# Altium schematic sheet Smart_Cube.SchDoc
size A2
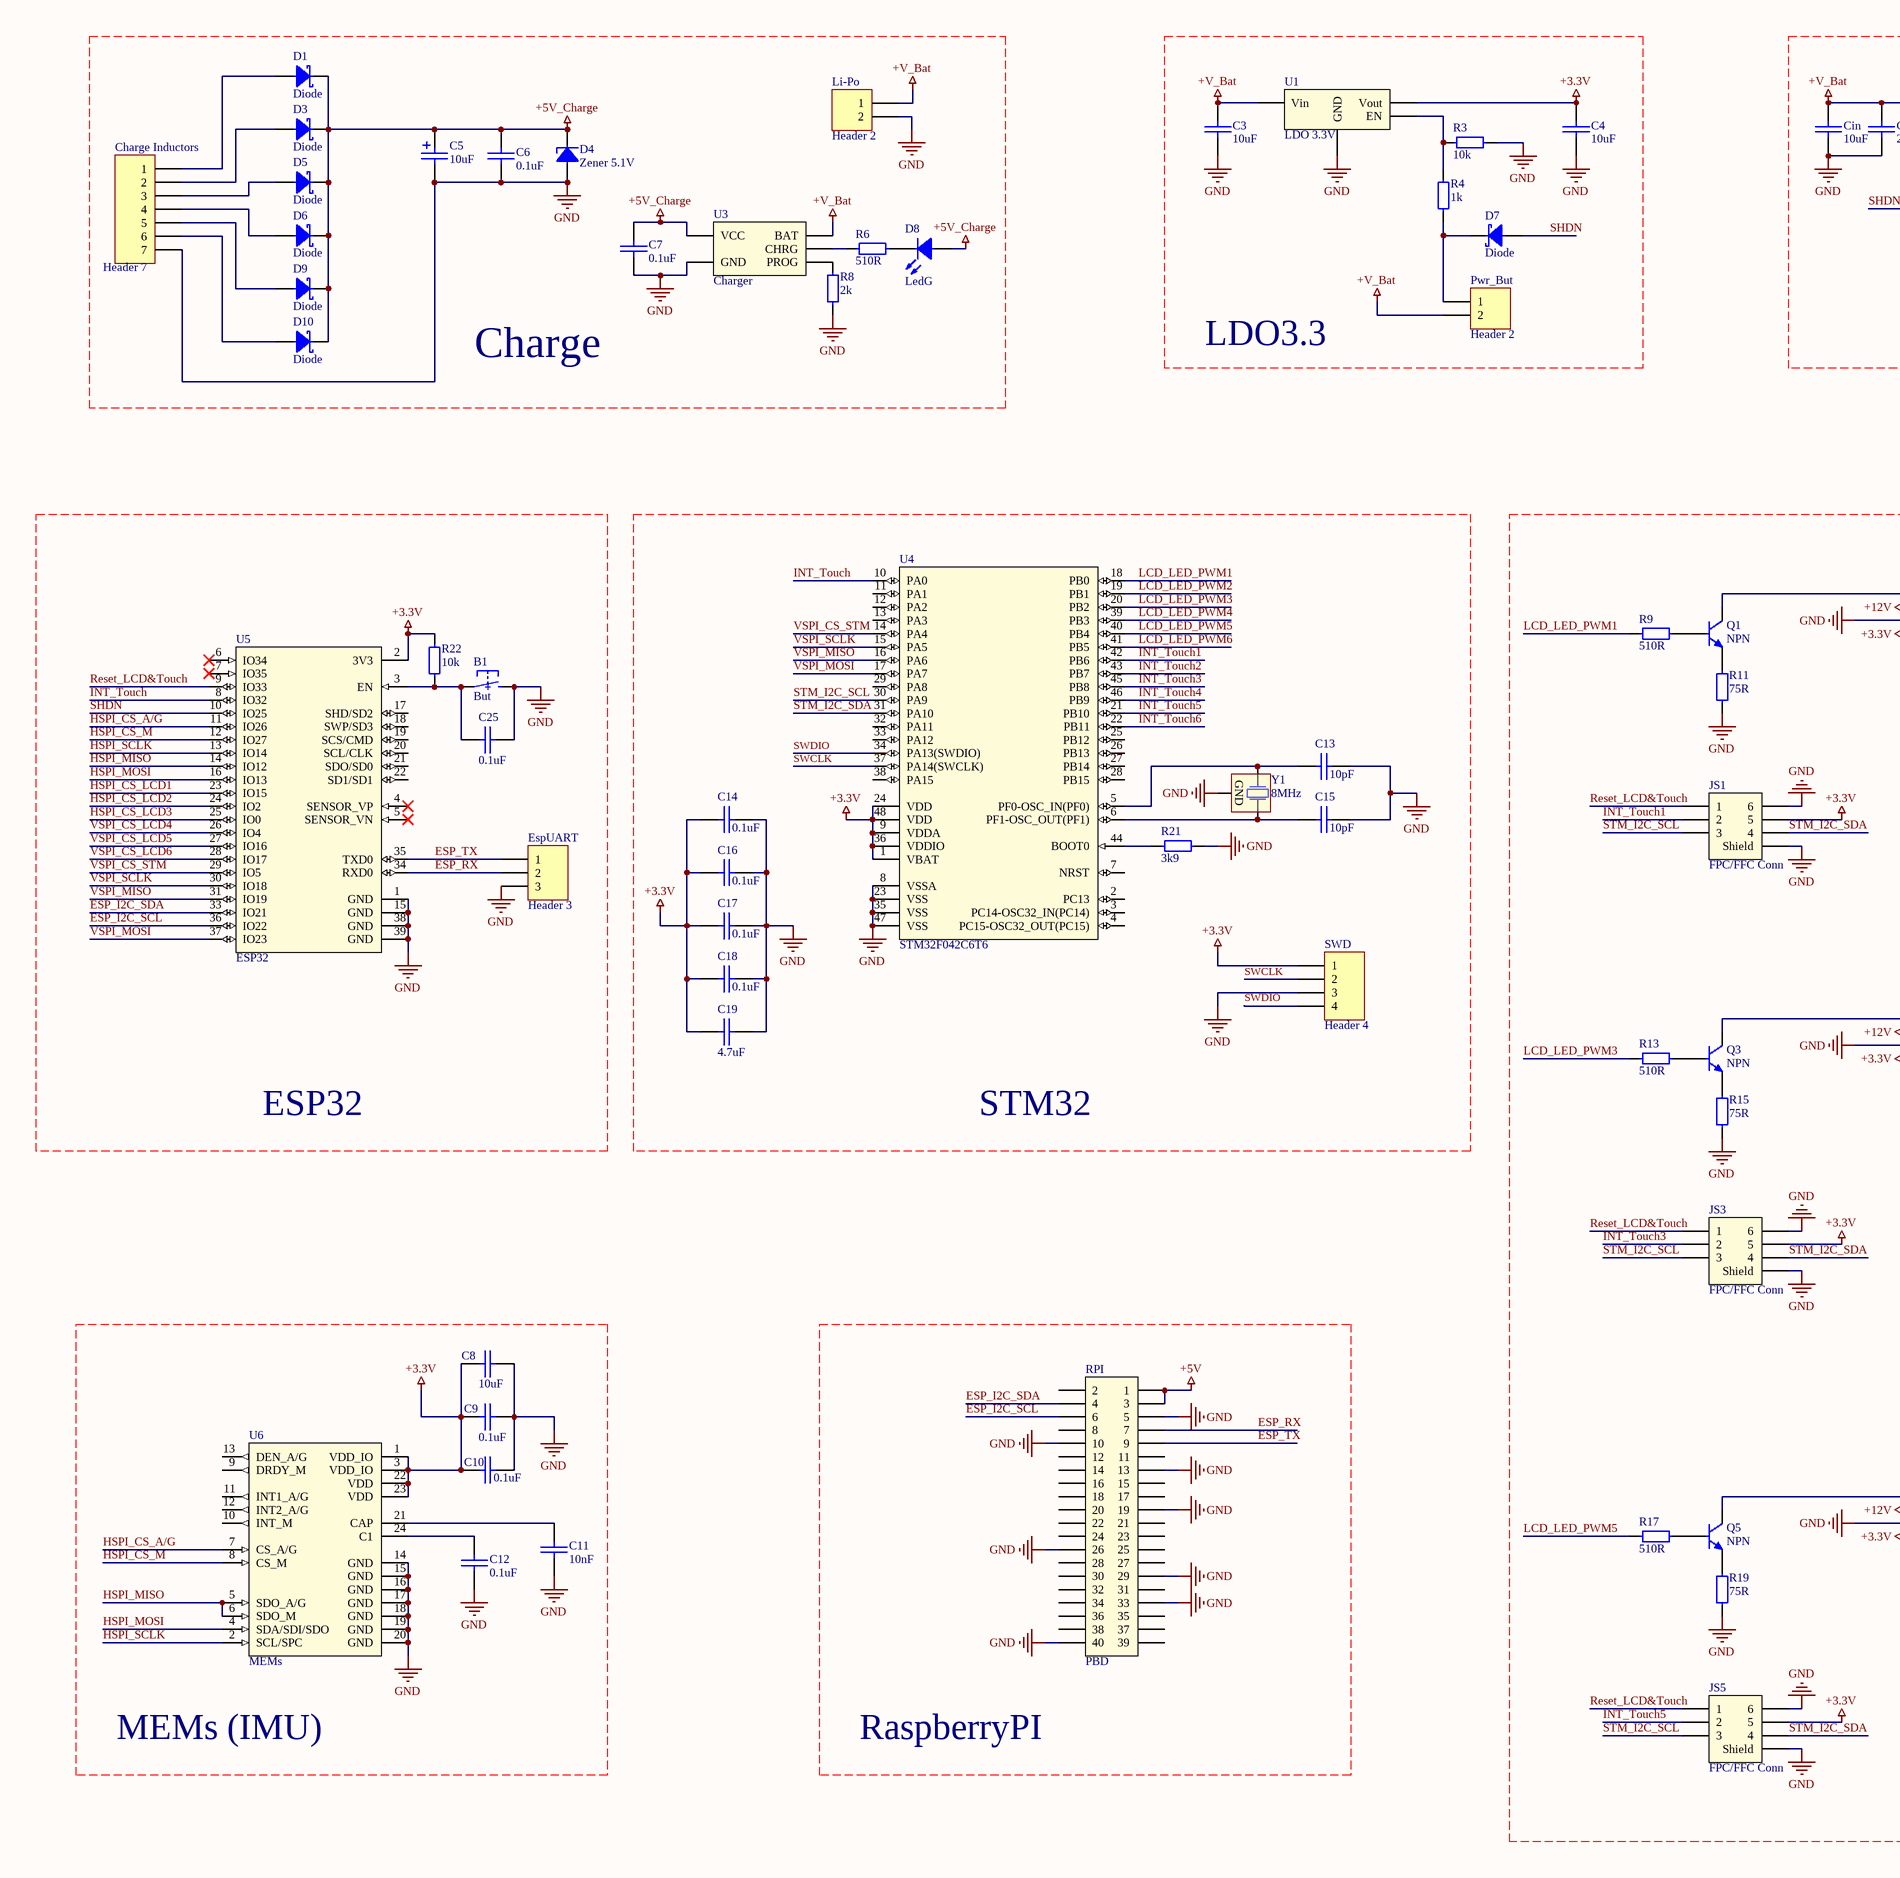
[diagram p0: Smart_Cube.SchDoc, left]
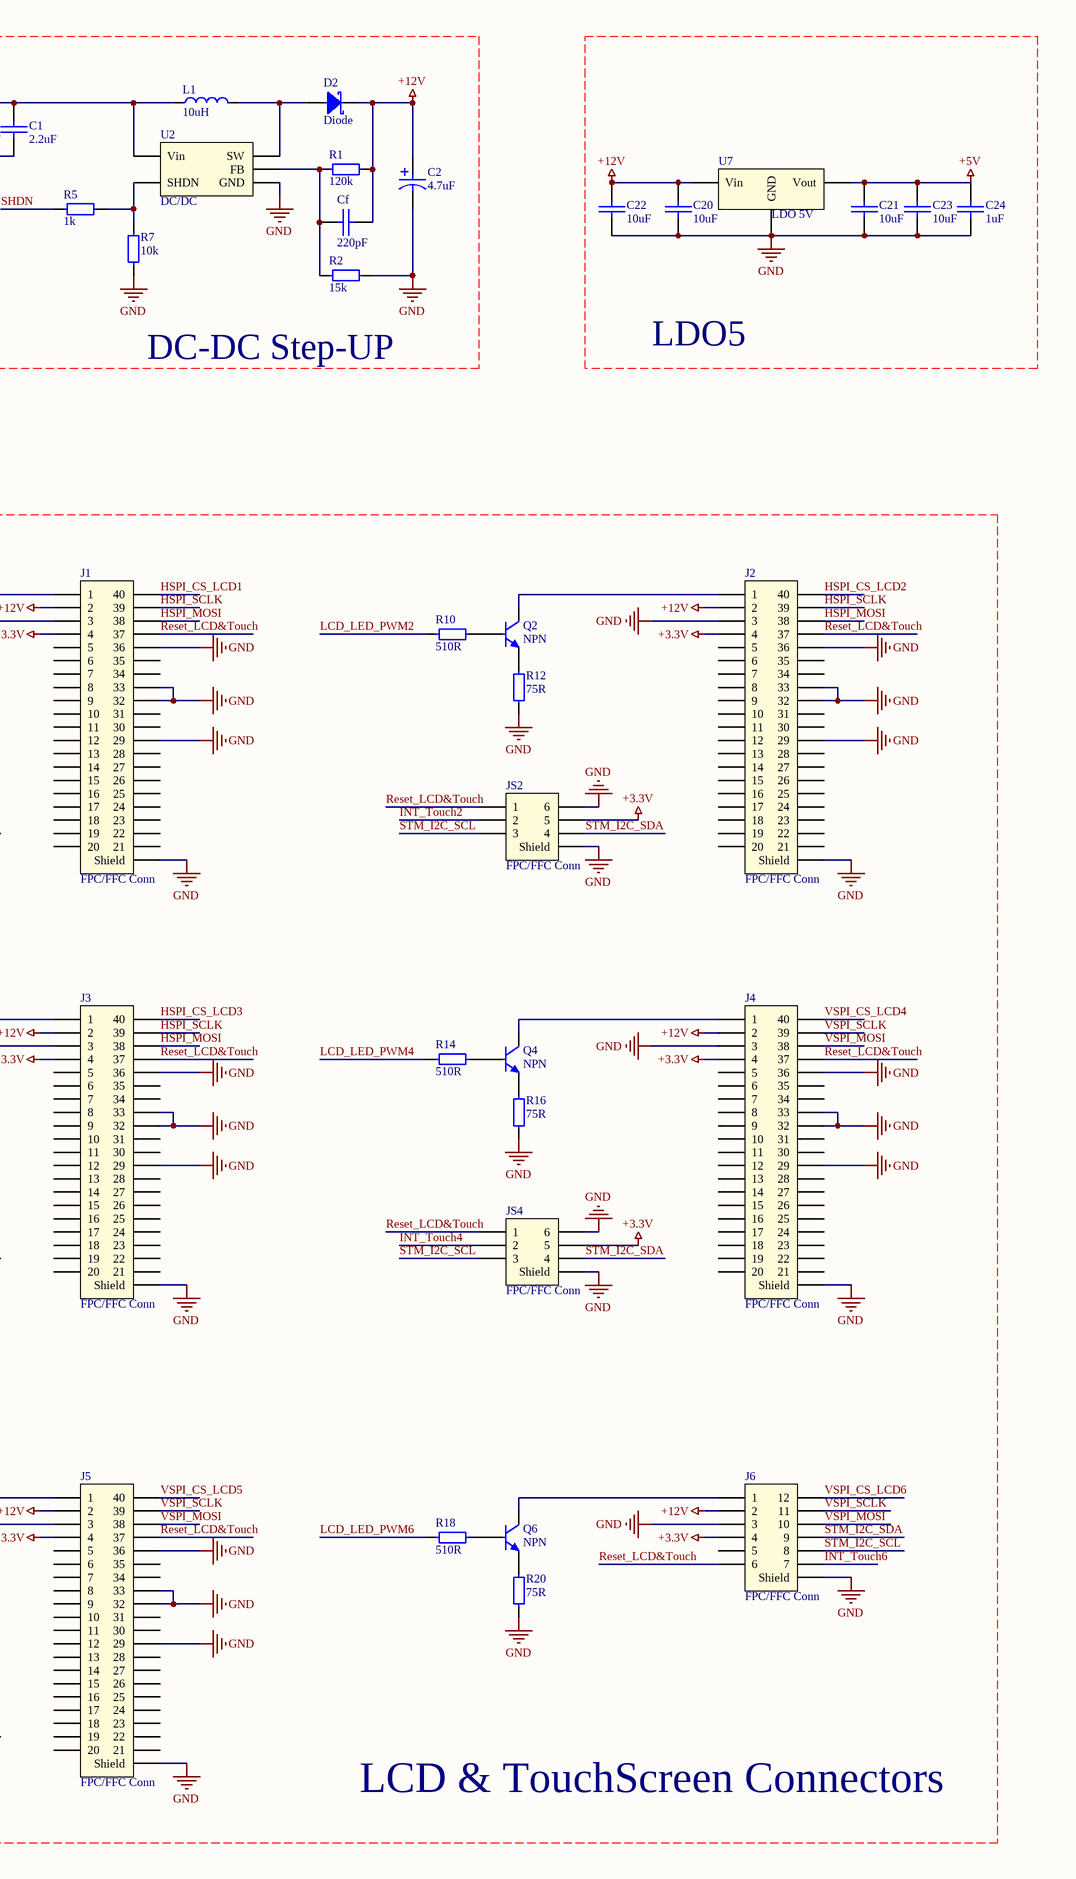
[diagram p1: Smart_Cube.SchDoc, right]

## Parts
B1  But  [BUTTON 4x3]
C1  2.2uF  [0603 Capicator]
C2  4.7uF  [Bar Cap 4x5.4]
C3  10uF  [0603 Capicator]
C4  10uF  [0603 Capicator]
C5  10uF  [TANTAL_A_CASE]
C6  0.1uF  [0603 Capicator]
C7  0.1uF  [0603 Capicator]
C8  10uF  [0603 Capicator]
C9  0.1uF  [0603 Capicator]
C10  0.1uF  [0603 Capicator]
C11  10nF  [0603 Capicator]
C12  0.1uF  [0603 Capicator]
C13  10pF  [0603 Capicator]
C14  0.1uF  [0603 Capicator]
C15  10pF  [0603 Capicator]
C16  0.1uF  [0603 Capicator]
C17  0.1uF  [0603 Capicator]
C18  0.1uF  [0603 Capicator]
C19  4.7uF  [0603 Capicator]
C20  10uF  [0603 Capicator]
C21  10uF  [0603 Capicator]
C22  10uF  [0603 Capicator]
C23  10uF  [0603 Capicator]
C24  1uF  [0603 Capicator]
C25  0.1uF  [0603 Capicator]
Cf  220pF  [0603 Capicator]
Charge_Inductors  Header 7  [HDR1X7]
Cin  10uF  [0603 Capicator]
D1  Diode  [sod-123]
D2  Diode  [sod-123]
D3  Diode  [sod-123]
D4  Zener 5.1V  [sod-323]
D5  Diode  [sod-123]
D6  Diode  [sod-123]
D7  Diode  [sod-123]
D8  LedG  [0805 LED]
D9  Diode  [sod-123]
D10  Diode  [sod-123]
EspUART  Header 3  [HDR1X3]
J1  FPC/FFC Conn  [FH12-40S Vertical]
J2  FPC/FFC Conn  [FH12-40S Vertical]
J3  FPC/FFC Conn  [FH12-40S Vertical]
J4  FPC/FFC Conn  [FH12-40S Vertical]
J5  FPC/FFC Conn  [FH12-40S Vertical]
J6  FPC/FFC Conn  [FH12-12S Vertical]
JS1  FPC/FFC Conn  [FH12-6s Vertical]
JS2  FPC/FFC Conn  [FH12-6s Vertical]
JS3  FPC/FFC Conn  [FH12-6s Vertical]
JS4  FPC/FFC Conn  [FH12-6s Vertical]
JS5  FPC/FFC Conn  [FH12-6s Vertical]
L1  10uH  [SDR]
Li-Po  Header 2  [HDR1X2]
Pwr_But  Header 2  [HDR1X2]
Q1  NPN  [SOT-23]
Q2  NPN  [SOT-23]
Q3  NPN  [SOT-23]
Q4  NPN  [SOT-23]
Q5  NPN  [SOT-23]
Q6  NPN  [SOT-23]
R1  120k  [0603 Resistor]
R2  15k  [0603 Resistor]
R3  10k  [0603 Resistor]
R4  1k  [0603 Resistor]
R5  1k  [0603 Resistor]
R6  510R  [0603 Resistor]
R7  10k  [0603 Resistor]
R8  2k  [0603 Resistor]
R9  510R  [0603 Resistor]
R10  510R  [0603 Resistor]
R11  75R  [0603 Resistor]
R12  75R  [0603 Resistor]
R13  510R  [0603 Resistor]
R14  510R  [0603 Resistor]
R15  75R  [0603 Resistor]
R16  75R  [0603 Resistor]
R17  510R  [0603 Resistor]
R18  510R  [0603 Resistor]
R19  75R  [0603 Resistor]
R20  75R  [0603 Resistor]
R21  3k9  [0603 Resistor]
R22  10k  [0603 Resistor]
RPI  PBD  [PBD 2x20]
SWD  Header 4  [HDR1X4]
U1  LDO 3.3V  [SOT-23-5]
U2  DC/DC  [SOT-23-5]
U3  Charger  [SOT-23-5]
U4  STM32F042C6T6  [LQFP48]
U5  ESP32  [ESP32-WROOM-32U]
U6  MEMs  [LGA 3.5x3x1 mm 24-lead]
U7  LDO 5V  [SOT-223]
Y1  8MHz  [Crystal ABM]

## Nets
+3.3V: C4.2 C8.1 C9.1 C10.1 C14.1 C16.1 C17.1 C18.1 C19.1 J1.4 J2.4 J3.4 J4.4 J5.4 J6.4 JS1.5 JS2.5 JS3.5 JS4.5 JS5.5 R22.2 SWD.1 U1.5(Vout) U4.1(VBAT) U4.9(VDDA) U4.24(VDD) U4.36(VDDIO) U4.48(VDD) U5.2(3V3) U6.1(VDD_IO) U6.3(VDD_IO) U6.22(VDD) U6.23(VDD)
+5V: C21.2 C23.2 C24.2 RPI.1 RPI.3 U7.2(Vout)
+5V_Charge: C5.2 C6.2 C7.2 D1.2 D3.2 D4.2 D5.2 D6.2 D8.1 D9.2 D10.2 U3.4(VCC)
+12V: C2.2 C20.2 C22.2 Cf.2 D2.2 J1.2 J2.2 J3.2 J4.2 J5.2 J6.2 R1.2 U7.3(Vin)
+V_Bat: C1.2 C3.2 Cin.2 L1.1 Li-Po.1 Pwr_But.2 U1.1(Vin) U2.5(Vin) U3.3(BAT)
GND: B1.2 C1.1 C2.1 C3.1 C4.1 C5.1 C6.1 C7.1 C8.2 C9.2 C10.2 C11.2 C12.2 C13.2 C14.2 C15.2 C16.2 C17.2 C18.2 C19.2 C20.1 C21.1 C22.1 C23.1 C24.1 C25.2 Charge_Inductors.7 Cin.1 D4.1 EspUART.3 J1.3 J1.29 J1.32 J1.33 J1.36 J1.A(Shield) J2.3 J2.29 J2.32 J2.33 J2.36 J2.A(Shield) J3.3 J3.29 J3.32 J3.33 J3.36 J3.A(Shield) J4.3 J4.29 J4.32 J4.33 J4.36 J4.A(Shield) J5.3 J5.29 J5.32 J5.33 J5.36 J5.A(Shield) J6.3 J6.A(Shield) JS1.6 JS1.A(Shield) JS2.6 JS2.A(Shield) JS3.6 JS3.A(Shield) JS4.6 JS4.A(Shield) JS5.6 JS5.A(Shield) Li-Po.2 R2.2 R3.2 R7.1 R8.1 R11.1 R12.1 R15.1 R16.1 R19.1 R20.1 R21.2 RPI.5 RPI.10 RPI.13 RPI.19 RPI.26 RPI.29 RPI.33 RPI.40 SWD.3 U1.2(GND) U2.2(GND) U3.2(GND) U4.8(VSSA) U4.23(VSS) U4.35(VSS) U4.47(VSS) U5.1(GND) U5.15(GND) U5.38(GND) U5.39(GND) U6.14(GND) U6.15(GND) U6.16(GND) U6.17(GND) U6.18(GND) U6.19(GND) U6.20(GND) U7.1(GND) Y1.GND
ESP_I2C_SCL: RPI.6 U5.36(IO22)
ESP_I2C_SDA: RPI.4 U5.33(IO21)
ESP_RX: EspUART.2 RPI.7 U5.34(RXD0)
ESP_TX: EspUART.1 RPI.9 U5.35(TXD0)
HSPI_CS_A/G: U5.11(IO26) U6.7(CS_A/G)
HSPI_CS_LCD1: J1.40 U5.23(IO15)
HSPI_CS_LCD2: J2.40 U5.24(IO2)
HSPI_CS_LCD3: J3.40 U5.25(IO0)
HSPI_CS_M: U5.12(IO27) U6.8(CS_M)
HSPI_MISO: U5.14(IO12) U6.5(SDO_A/G) U6.6(SDO_M)
HSPI_MOSI: J1.38 J2.38 J3.38 U5.16(IO13) U6.4(SDA/SDI/SDO)
HSPI_SCLK: J1.39 J2.39 J3.39 U5.13(IO14) U6.2(SCL/SPC)
INT_Touch: U4.10(PA0) U5.8(IO32)
INT_Touch1: JS1.2 U4.42(PB6)
INT_Touch2: JS2.2 U4.43(PB7)
INT_Touch3: JS3.2 U4.45(PB8)
INT_Touch4: JS4.2 U4.46(PB9)
INT_Touch5: JS5.2 U4.21(PB10)
INT_Touch6: J6.7 U4.22(PB11)
LCD_LED_PWM1: R9.1 U4.18(PB0)
LCD_LED_PWM2: R10.1 U4.19(PB1)
LCD_LED_PWM3: R13.1 U4.20(PB2)
LCD_LED_PWM4: R14.1 U4.39(PB3)
LCD_LED_PWM5: R17.1 U4.40(PB4)
LCD_LED_PWM6: R18.1 U4.41(PB5)
Reset_LCD&Touch: J1.37 J2.37 J3.37 J4.37 J5.37 J6.6 JS1.1 JS2.1 JS3.1 JS4.1 JS5.1 U5.9(IO33)
SHDN: D7.1 R5.2 U5.10(IO25)
STM_I2C_SCL: J6.8 JS1.3 JS2.3 JS3.3 JS4.3 JS5.3 U4.30(PA9)
STM_I2C_SDA: J6.9 JS1.4 JS2.4 JS3.4 JS4.4 JS5.4 U4.31(PA10)
SWCLK: SWD.2 U4.37(PA14(SWCLK))
SWDIO: SWD.4 U4.34(PA13(SWDIO))
VSPI_CS_LCD4: J4.40 U5.26(IO4)
VSPI_CS_LCD5: J5.40 U5.27(IO16)
VSPI_CS_LCD6: J6.12 U5.28(IO17)
VSPI_CS_STM: U4.14(PA4) U5.29(IO5)
VSPI_MISO: U4.16(PA6) U5.31(IO19)
VSPI_MOSI: J4.38 J5.38 J6.10 U4.17(PA7) U5.37(IO23)
VSPI_SCLK: J4.39 J5.39 J6.11 U4.15(PA5) U5.30(IO18)
NetB1_1: B1.1 C25.1 R22.1 U5.3(EN)
NetC11_1: C11.1 U6.21(CAP)
NetC12_1: C12.1 U6.24(C1)
NetC13_1: C13.1 U4.5(PF0-OSC_IN(PF0)) Y1.1
NetC15_1: C15.1 U4.6(PF1-OSC_OUT(PF1)) Y1.2
NetCf_1: Cf.1 R1.1 R2.1 U2.3(FB)
NetCharge_Inductors_1: Charge_Inductors.1 D1.1
NetCharge_Inductors_2: Charge_Inductors.2 D3.1
NetCharge_Inductors_3: Charge_Inductors.3 D5.1
NetCharge_Inductors_4: Charge_Inductors.4 D6.1
NetCharge_Inductors_5: Charge_Inductors.5 D9.1
NetCharge_Inductors_6: Charge_Inductors.6 D10.1
NetD2_1: D2.1 L1.2 U2.1(SW)
NetD7_2: D7.2 Pwr_But.1 R4.1
NetD8_2: D8.2 R6.2
NetJ1_1: J1.1 Q1.3
NetJ2_1: J2.1 Q2.3
NetJ3_1: J3.1 Q3.3
NetJ4_1: J4.1 Q4.3
NetJ5_1: J5.1 Q5.3
NetJ6_1: J6.1 Q6.3
NetQ1_1: Q1.1 R9.2
NetQ1_2: Q1.2 R11.2
NetQ2_1: Q2.1 R10.2
NetQ2_2: Q2.2 R12.2
NetQ3_1: Q3.1 R13.2
NetQ3_2: Q3.2 R15.2
NetQ4_1: Q4.1 R14.2
NetQ4_2: Q4.2 R16.2
NetQ5_1: Q5.1 R17.2
NetQ5_2: Q5.2 R19.2
NetQ6_1: Q6.1 R18.2
NetQ6_2: Q6.2 R20.2
NetR3_1: R3.1 R4.2 U1.3(EN)
NetR5_1: R5.1 R7.2 U2.4(SHDN)
NetR6_1: R6.1 U3.1(CHRG)
NetR8_2: R8.2 U3.5(PROG)
NetR21_1: R21.1 U4.44(BOOT0)

Not connected (* = marked no-connect by the designer): J1 5 6 7 8 9 10 11 12 13 14 15 16 17 18 19 20 21 22 23 24 25 26 27 28 30 31 34 35; J2 5 6 7 8 9 10 11 12 13 14 15 16 17 18 19 20 21 22 23 24 25 26 27 28 30 31 34 35; J3 5 6 7 8 9 10 11 12 13 14 15 16 17 18 19 20 21 22 23 24 25 26 27 28 30 31 34 35; J4 5 6 7 8 9 10 11 12 13 14 15 16 17 18 19 20 21 22 23 24 25 26 27 28 30 31 34 35; J5 5 6 7 8 9 10 11 12 13 14 15 16 17 18 19 20 21 22 23 24 25 26 27 28 30 31 34 35; J6 5; RPI 2 8 11 12 14 15 16 17 18 20 21 22 23 24 25 27 28 30 31 32 34 35 36 37 38 39; U4 2(PC13) 3(PC14-OSC32_IN(PC14)) 4(PC15-OSC32_OUT(PC15)) 7(NRST) 11(PA1) 12(PA2) 13(PA3) 25(PB12) 26(PB13) 27(PB14) 28(PB15) 29(PA8) 32(PA11) 33(PA12) 38(PA15); U5 4(SENSOR_VP)* 5(SENSOR_VN)* 6(IO34)* 7(IO35)* 17(SHD/SD2) 18(SWP/SD3) 19(SCS/CMD) 20(SCL/CLK) 21(SDO/SD0) 22(SD1/SD1); U6 9(DRDY_M) 10(INT_M) 11(INT1_A/G) 12(INT2_A/G) 13(DEN_A/G)

## Notes on the sheet
- Charge
- LDO3.3
- DC-DC Step-UP
- LDO5
- ESP32
- STM32
- MEMs (IMU)
- RaspberryPI
- LCD & TouchScreen Connectors

## Library data of the parts
B1 = Button 2 Conn: Button 2 Conn SMD; Part Number: L-KLS7-TS3608-5.0-180; Manufacturer: KLS electronic co ltd; Type: Button; ComponentLink1Description: Chip&Dip; ComponentLink1URL: https://www.chipdip.ru/product/kls7-ts3608-5.0-180-td-02xa
C1 = Cap 2.2uF (0603): 2.2uF X5R 10V 10% 0603; Manufacturer: Murata Manufacturing; Part Number: GRM188R61A225KE34D; Type: Capacitor; ComponentLink1Description: Chip&Dip; ComponentLink1URL: https://www.chipdip.ru/product/grm188r61a225k
C2 = Cap Pol 4.7uF: ECAP SMD,  35V, 105°C; Part Number: B41121A7475M000; Manufacturer: Epcos; Type: Capacitor; ComponentLink1Description: Chip&Dip; ComponentLink1URL: https://www.chipdip.ru/product/b41121a7475m000
C3 C4 C8 C20-C23 = Cap 10uF (0603): 10uF X5R 25V 20% 0603; Manufacturer: Murata Manufacturing; Part Number: GRM188R61E106M; Type: Capacitor; ComponentLink1Description: Chip&Dip; ComponentLink1URL: https://www.chipdip.ru/product/grm188r61e106m
C5 = Cap Tantal 10uF (SMDA): TECAP, 10uF, 16V, case A, 10%; Part Number: 373033076; Manufacturer: China; Type: Capacitor; ComponentLink1Description: Chip&Dip; ComponentLink1URL: https://www.chipdip.ru/product0/373033076
C6 C7 C9 C10 C12 C14 C16-C18 C25 = Cap 0.1uF (0603): 0.1uF X7R 16V 10% 0603; Manufacturer: Murata Manufacturing; Part Number: GRM188R71C104KA01D; Type: Capacitor; ComponentLink1Description: Chip&Dip; ComponentLink1URL: https://www.chipdip.ru/product/grm188r71c104ka01d
C11 = Cap 10nF (0603): X7R 10nF 100V 10% 0603; Manufacturer: Murata Manufacturing; Part Number: GRM188R72A103KA01D; Type: Capacitor; ComponentLink1Description: Chip&Dip; ComponentLink1URL: https://www.chipdip.ru/product/grm188r72a103ka01d
C13 C15 = Cap 10pF (0603): 10pF NP0 50V 5% 0603; Manufacturer: Murata Manufacturing; Part Number: GRM1885C1H100JA01D; Type: Capacitor; ComponentLink1Description: Chip&Dip; ComponentLink1URL: https://www.chipdip.ru/product/grm1885c1h100j
C19 = Cap 4.7uF (0603): 4.7uF X5R 6.3V 10% 0603; Manufacturer: Murata Manufacturing; Part Number: GRM188R60J475KE19D; Type: Capacitor; ComponentLink1Description: Chip&Dip; ComponentLink1URL: https://www.chipdip.ru/product/grm185r60g475me15d
C24 = Cap 1uF (0603): 1uF X5R 25V 10% 0603; Manufacturer: Murata Manufacturing; Part Number: GRM188R61E105KAADD; Type: Capacitor; ComponentLink1Description: Chip&Dip; ComponentLink1URL: https://www.chipdip.ru/product/grm188r61e105k
Cf = Cap 220pF (0603): 220pF NP0 50V 5% 0603; Manufacturer: Murata Manufacturing; Part Number: GRM1885C1H221J; Type: Capacitor; ComponentLink1Description: Chip&Dip; ComponentLink1URL: https://www.chipdip.ru/product/grm1885c1h221j
Charge_Inductors = Header 7: Header, 7-Pin; LatestRevisionDate: 17-Jul-2002; LatestRevisionNote: Re-released for DXP Platform.; Publisher: Altium Limited
Cin = Cap 10uF (0603): 10uF X5R 25V 20% 0603; Manufacturer: Murata Manufacturing; Part Number: GRM188R61E106M; Type: Capacitor; ComponentLink1Description: Chip&Dip; ComponentLink1URL: https://www.chipdip.ru/product/grm188r61e106m
D1-D3 D5-D7 D9 D10 = Diode Schottky (SOD-123): 0.5 A, Low Forward Voltage less than 385 mV, 400 mW Power Dissipation Package; Part Number: MBR0520L; Manufacturer: ON Semiconductor; Type: Diode; ComponentLink1Description: DataSheet; ComponentLink1URL: http://www.farnell.com/datasheets/1875336.pdf; ComponentLink2Description: Chip&Dip; ComponentLink2URL: https://www.chipdip.ru/product/mbr0520l
D4 = Zener Diode 5.1V: 300mW; Part Number: BZX384-C5V1,115; Manufacturer: Nexperia; Type: Diode; ComponentLink1Description: Chip&Dip; ComponentLink1URL: https://www.chipdip.ru/product/bzx384-c5v1; ComponentLink2Description: DataSheet; ComponentLink2URL: https://static.chipdip.ru/lib/164/DOC001164636.pdf
D8 = Led Green: Led Green SMD 1608, 120°, 525nM; Part Number: TO-1608BC-PG; Manufacturer: Taiwan Oasis Technology; Type: Diode; ComponentLink1Description: Chip&Dip; ComponentLink1URL: https://www.chipdip.ru/product/to-1608bc-pg
EspUART = Header 3: Header, 3-Pin; LatestRevisionDate: 17-Jul-2002; LatestRevisionNote: Re-released for DXP Platform.; Publisher: Altium Limited
J1-J5 = Conn40x1 (FH12 Vertical): Connector to Display's trail; Part Number: FH12-40S-0.5SVA(54); Manufacturer: Hirose Electric; Type: Connector; ComponentLink1Description: Chip&Dip; ComponentLink1URL: https://www.chipdip.ru/product1/8002082143
J6 = Conn12x1 (FH12 Vertical): Connector to trail; Part Number: FH12-12S-0.5SVA(54); Manufacturer: Hirose Electric; Type: Connector; ComponentLink1Description: Mouser; ComponentLink1URL: https://ru.mouser.com/ProductDetail/Hirose-Connector/FH12-12S-05SVA54?qs=%2Fha2pyFadugx2rsdyHDVcXwbI8krQaq6%252BPNTW5YGSdYzC8JBsy5pU75ViyDjvRCP
JS1-JS5 = Conn6x1 (FH12 Vertical): Connector to touch sensor's trail; Part Number: FH12-6S-0.5SVA(54); Manufacturer: Hirose Electric; Type: Connector; ComponentLink1Description: Mouser; ComponentLink1URL: https://ru.mouser.com/ProductDetail/Hirose-Connector/FH12-6S-05SVA54?qs=%2Fha2pyFaduhYbZFVunKSgIpYMlkzngMoGcACEbztduQ1P2V6tcZCQQ%3D%3D
L1 = Inductor 10uH (1.5A): 10uH, D=5.8mm, 1450mA; Part Number: SDR0604-100ML; Manufacturer: Bourns; Type: Inductor; ComponentLink1Description: DataSheet; ComponentLink1URL: http://www.farnell.com/datasheets/1635216.pdf; ComponentLink2Description: Chip&Dip; ComponentLink2URL: https://www.chipdip.ru/product/sdr0604-100ml
Li-Po Pwr_But = Header 2: Header, 2-Pin; LatestRevisionDate: 17-Jul-2002; LatestRevisionNote: Re-released for DXP Platform.; Publisher: Altium Limited
Q1-Q6 = NPN [BC817]: NPN general-purpose transistors; Part Number: BC817-40,215; Manufacturer: Nexperia; Type: Transistor; ComponentLink1Description: DataSheet; ComponentLink1URL: https://static.chipdip.ru/lib/156/DOC000156781.pdf; ComponentLink2Description: Chip&Dip; ComponentLink2URL: https://www.chipdip.ru/product/bc817-40
R1 = Res 120k (0603): 0.1W 0603 120k, 1%; Part Number: RC0603FR-07120KL; Manufacturer: Taiwan; Type: Resistor; ComponentLink1Description: Chip&Dip; ComponentLink1URL: https://www.chipdip.ru/product0/9000079762
R2 = Res 15k (0603): 0.1W 0603 15k, 1%; Part Number: RC0603FR-0715KL; Manufacturer: Taiwan; Type: Resistor; ComponentLink1Description: Chip&Dip; ComponentLink1URL: https://www.chipdip.ru/product0/9000079740
R3 R7 R22 = Res 10k (0603): 0.1W 0603 10k, 1%; Part Number: RC0603FR-0710KL; Manufacturer: Taiwan; Type: Resistor; ComponentLink1Description: Chip&Dip; ComponentLink1URL: https://www.chipdip.ru/product0/9000079736
R4 R5 = Res 1k (0603): 0.1W 0603 1k, 1%; Part Number: RC0603FR-071KL; Manufacturer: Taiwan; Type: Resistor; ComponentLink1Description: Chip&Dip; ComponentLink1URL: https://www.chipdip.ru/product0/9000079676
R6 R9 R10 R13 R14 R17 R18 = Res 510R (0603): 0.1W 0603 510R, 1%; Part Number: RC0603FR-07510RL; Manufacturer: Taiwan; Type: Resistor; ComponentLink1Description: Chip&Dip; ComponentLink1URL: https://www.chipdip.ru/product0/9000079669
R8 = Res 2k (0603): 0.1W 0603 2k, 1%; Part Number: RC0603FR-072KL; Manufacturer: Taiwan; Type: Resistor; ComponentLink1Description: Chip&Dip; ComponentLink1URL: https://www.chipdip.ru/product0/9000079719
R11 R12 R15 R16 R19 R20 = Res 75R (0603): 0.1W 0603 75R, 1%; Part Number: RC0603FR-0775RL; Manufacturer: Taiwan; Type: Resistor; ComponentLink1Description: Chip&Dip; ComponentLink1URL: https://www.chipdip.ru/product0/9000079613
R21 = Res 3.9k (0603): 0.1W 0603 3.9k, 1%; Part Number: RC0603FR-073K9L; Manufacturer: Taiwan; Type: Resistor; ComponentLink1Description: Chip&Dip; ComponentLink1URL: https://www.chipdip.ru/product0/9000079726
RPI = Conn20x2 (PBD): Female for PLD; Part Number: DS1023-2*20S21; Manufacturer: Ningbo connfly electronic; Type: Connector; ComponentLink1Description: Chip&Dip; ComponentLink1URL: https://www.chipdip.ru/product/pbd-40
SWD = Header 4: Header, 4-Pin; LatestRevisionDate: 17-Jul-2002; LatestRevisionNote: Re-released for DXP Platform.; Publisher: Altium Limited
U1 = LDO 3.3V [LM]: low-dropout linear regulator. There are devices designed specifically for battery-operated systems. Ground current is very small (50uA-Typ), that significantly extending battery life. Low power consumption and high accuracy is achieved through CMOS and programmable fuse technologies. Output voltage: 1.5V to 6.0V.; Part Number: LM8805SF5-3.3; Manufacturer: TAEJIN TECHNOLOGY; ComponentLink1Description: DataSheet; ComponentLink1URL: https://static.chipdip.ru/lib/138/DOC004138842.pdf; ComponentLink2Description: Chip&Dip; ComponentLink2URL: https://www.chipdip.ru/product/lm8805sf5-3.3
U2 = DC/DC Controller [LM2731]: The  LM2731  switching  regulators  are  current-mode  boostconverters  operating  at  fixed  frequencies  of  1.6  MHz  (“X”option) and 600 kHz (“Y” option).; Manufacturer: Texas Instruments; Part Number: LM2731YMF/NOPB; ComponentLink1Description: Chip&Dip; ComponentLink1URL: https://www.chipdip.ru/product/lm2731ymf-nopb; ComponentLink2Description: DataSheet; ComponentLink2URL: https://static.chipdip.ru/lib/491/DOC000491907.pdf; Type: IC
U3 = Charger [LTC]: The LTC®4054 is a complete constant-current/constant-voltage linear charger for single cell lithium-ion batteries.Its ThinSOT package and low external component countmake the LTC4054 ideally suited for portable applications.Furthermore, the LTC4054 is specifically designed to workwithin USB power specifications; Part Number: LTC4054ES5-4.2#PBF; Manufacturer: Linear Technology; ComponentLink2Description: Chip&Dip; ComponentLink2URL: https://www.chipdip.ru/product/ltc4054es5-4.2; Type: IC; ComponentLink3Description: DataSheet; ComponentLink3URL: https://static.chipdip.ru/lib/760/DOC000760847.pdf
U4 = STM32F042C6T6: ARM®-based 32-bit MCU, up to 32 KB Flash, crystal-less USB / FS 2.0, CAN, 9 timers, ADC and comm. interfaces, 2.0 - 3.6 V; Manufacturer: STMicroelectronics; Part Number: STM32F042C6T6; ComponentLink1Description: DataSheet; ComponentLink1URL: https://ru.mouser.com/datasheet/2/389/stm32f042c4-956225.pdf; ComponentLink2Description: Chip&Dip; ComponentLink2URL: https://www.chipdip.ru/product1/8000831125; Type: IC
U5 = ESP32-WROOM (D0WD): ESP32-WROOM-32 is a powerful, generic Wi-Fi+BT+BLE MCU module that targets a wide variety of applications,ranging from low-power sensor networks to the most demanding tasks, such as voice encoding, music streamingand MP3 decoding; Part Number: ESP32-WROOM-32U (16MB); Manufacturer: Espressif Systems; ComponentLink1Description: Mouser; ComponentLink1URL: https://ru.mouser.com/ProductDetail/Espressif-Systems/ESP32-WROOM-32U-16MB?qs=sGAEpiMZZMu3sxpa5v1qrsMD9%252BwKyL2mrwTVktUnYUY%3D; ComponentLink2Description: DataSheet; ComponentLink2URL: https://ru.mouser.com/datasheet/2/891/esp32-wroom-32d_esp32-wroom-32u_datasheet_en-1365844.pdf; Type: IC
U6 = MEMs 9 Axis: System-in-package featuring a 3D digital linear acceleration sensor, a 3D digital angular rate sensor, and a 3D digital magnetic sensor; Manufacturer: STMicroelectronics; Part Number: LSM9DS1TR; ComponentLink1Description: DataSheet; ComponentLink1URL: https://static.chipdip.ru/lib/427/DOC004427868.pdf; ComponentLink2Description: Chip&Dip; ComponentLink2URL: https://www.chipdip.ru/product/lsm9ds1tr; Type: IC
U7 = LDO 5V [LM]: A low dropout Linear Regulator with a dropout of 5V at 800mA of load current; Part Number: LM1117IMPX-5.0/NOPB; Manufacturer: Texas Instruments; ComponentLink1Description: DataSheet; ComponentLink1URL: https://static.chipdip.ru/lib/276/DOC000276680.pdf; ComponentLink2Description: Chip&Dip; ComponentLink2URL: https://www.chipdip.ru/product/lm1117impx-5.0-nopb
Y1 = Crystal 8MHz [ABM]: 8.0MHz 10pf 10ppm -10C +60C; Manufacturer: ABRACON; Part Number: ABM3B-8.000MHZ-10-1UT; Type: Crystal; ComponentLink1Description: Mouser; ComponentLink1URL: https://ru.mouser.com/ProductDetail/ABRACON/ABM3B-8000MHZ-10-1UT?qs=sGAEpiMZZMsBj6bBr9Q9aQYUWCbsL2Wc65je5Ut7byg%3D; ComponentLink2Description: DataSheet; ComponentLink2URL: https://ru.mouser.com/datasheet/2/3/abm3b-39910.pdf